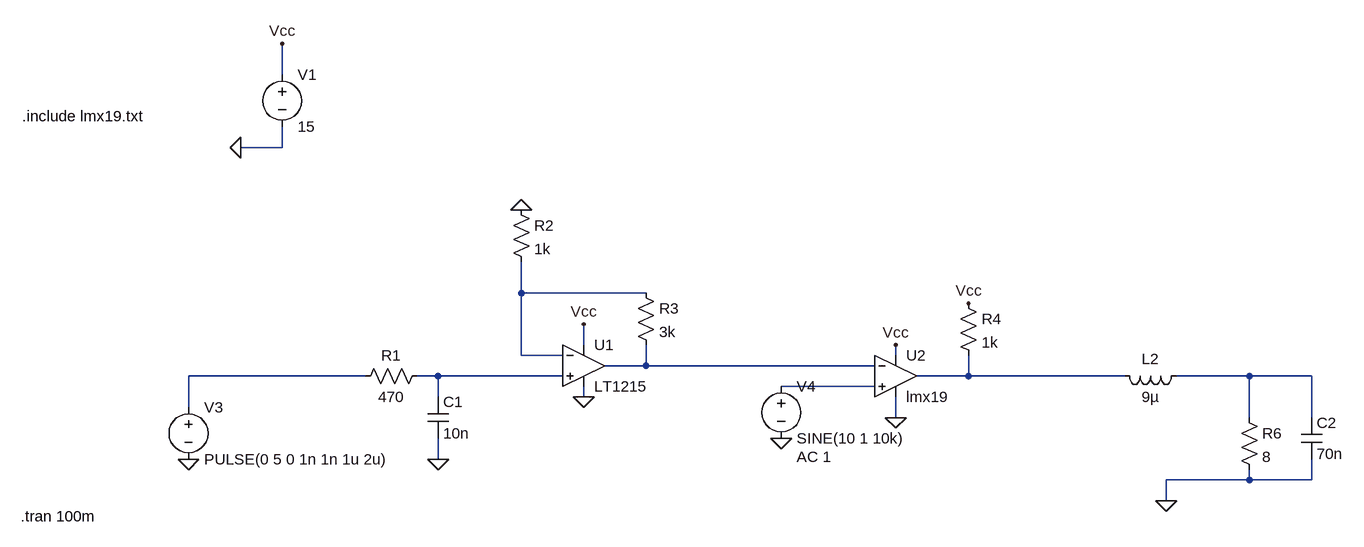
[diagram p0: schematic Entrada-micro-500khz.asc]
Entrada-micro-500khz.asc, the LTspice schematic file:
Version 4
SHEET 1 2696 900
WIRE 944 -128 944 -176
WIRE 944 -16 944 -48
WIRE 944 -16 880 -16
WIRE 1312 208 1312 160
WIRE 1504 208 1312 208
WIRE 1408 288 1408 256
WIRE 1312 304 1312 208
WIRE 1376 304 1312 304
WIRE 1888 304 1888 288
WIRE 1504 320 1504 288
WIRE 1504 320 1440 320
WIRE 1856 320 1504 320
WIRE 1072 336 800 336
WIRE 1184 336 1152 336
WIRE 1376 336 1184 336
WIRE 2000 336 2000 304
WIRE 2000 336 1920 336
WIRE 2240 336 2000 336
WIRE 2432 336 2320 336
WIRE 2528 336 2432 336
WIRE 1856 352 1712 352
WIRE 1184 368 1184 336
WIRE 1408 368 1408 352
WIRE 800 384 800 336
WIRE 1888 400 1888 368
WIRE 2432 400 2432 336
WIRE 2528 400 2528 336
WIRE 1184 464 1184 432
WIRE 2432 496 2432 480
WIRE 2432 496 2304 496
WIRE 2528 496 2528 464
WIRE 2528 496 2432 496
WIRE 2304 528 2304 496
FLAG 880 -16 0
FLAG 944 -176 Vcc
FLAG 800 464 0
FLAG 1184 464 0
FLAG 1312 80 0
FLAG 1408 368 0
FLAG 1408 256 Vcc
FLAG 1888 288 Vcc
FLAG 1712 432 0
FLAG 2000 224 Vcc
FLAG 2304 528 0
FLAG 1888 400 0
SYMBOL voltage 944 -144 R0
SYMATTR InstName V1
SYMATTR Value 15
SYMBOL voltage 800 368 R0
WINDOW 123 0 0 Left 2
WINDOW 39 0 0 Left 2
SYMATTR InstName V3
SYMATTR Value PULSE(0 5 0 1n 1n 1u 2u)
SYMBOL res 1168 320 R90
WINDOW 0 0 56 VBottom 2
WINDOW 3 32 56 VTop 2
SYMATTR InstName R1
SYMATTR Value 470
SYMBOL cap 1168 368 R0
SYMATTR InstName C1
SYMATTR Value 10n
SYMBOL res 1296 64 R0
SYMATTR InstName R2
SYMATTR Value 1k
SYMBOL res 1488 192 R0
SYMATTR InstName R3
SYMATTR Value 3k
SYMBOL Opamps\\LT1215 1408 256 R0
SYMATTR InstName U1
SYMBOL Opamps\\opamp2 1888 272 R0
SYMATTR InstName U2
SYMATTR Value lmx19
SYMBOL voltage 1712 336 R0
WINDOW 123 24 124 Left 2
WINDOW 39 0 0 Left 2
SYMATTR Value2 AC 1
SYMATTR InstName V4
SYMATTR Value SINE(10 1 10k)
SYMBOL res 1984 208 R0
SYMATTR InstName R4
SYMATTR Value 1k
SYMBOL ind 2336 320 R90
WINDOW 0 5 56 VBottom 2
WINDOW 3 32 56 VTop 2
SYMATTR InstName L2
SYMATTR Value 9µ
SYMBOL res 2416 384 R0
SYMATTR InstName R6
SYMATTR Value 8
SYMBOL cap 2512 400 R0
SYMATTR InstName C2
SYMATTR Value 70n
TEXT 544 -64 Left 2 !.include lmx19.txt
TEXT 542 552 Left 2 !.tran 100m

The netlist it stands for:
* Entrada-micro-500khz.asc
V1 Vcc 0 15
V3 N003 0 PULSE(0 5 0 1n 1n 1u 2u)
R1 N004 N003 470
C1 N004 0 10n
R2 0 N001 1k
R3 N001 N002 3k
XU1 N004 N001 Vcc 0 N002 LT1215  ; pins In+ In- V+ V- OUT
XU2 N007 N002 Vcc 0 N005 lmx19  ; pins In+ In- V+ V- OUT
V4 N007 0 SINE(10 1 10k) AC 1
R4 Vcc N005 1k
L2 N006 N005 9µ
R6 N006 0 8
C2 N006 0 70n
.include lmx19.txt
.tran 100m
.lib LTC.lib
.backanno
.end